# Altium project VESC_MotorController.PrjPcb
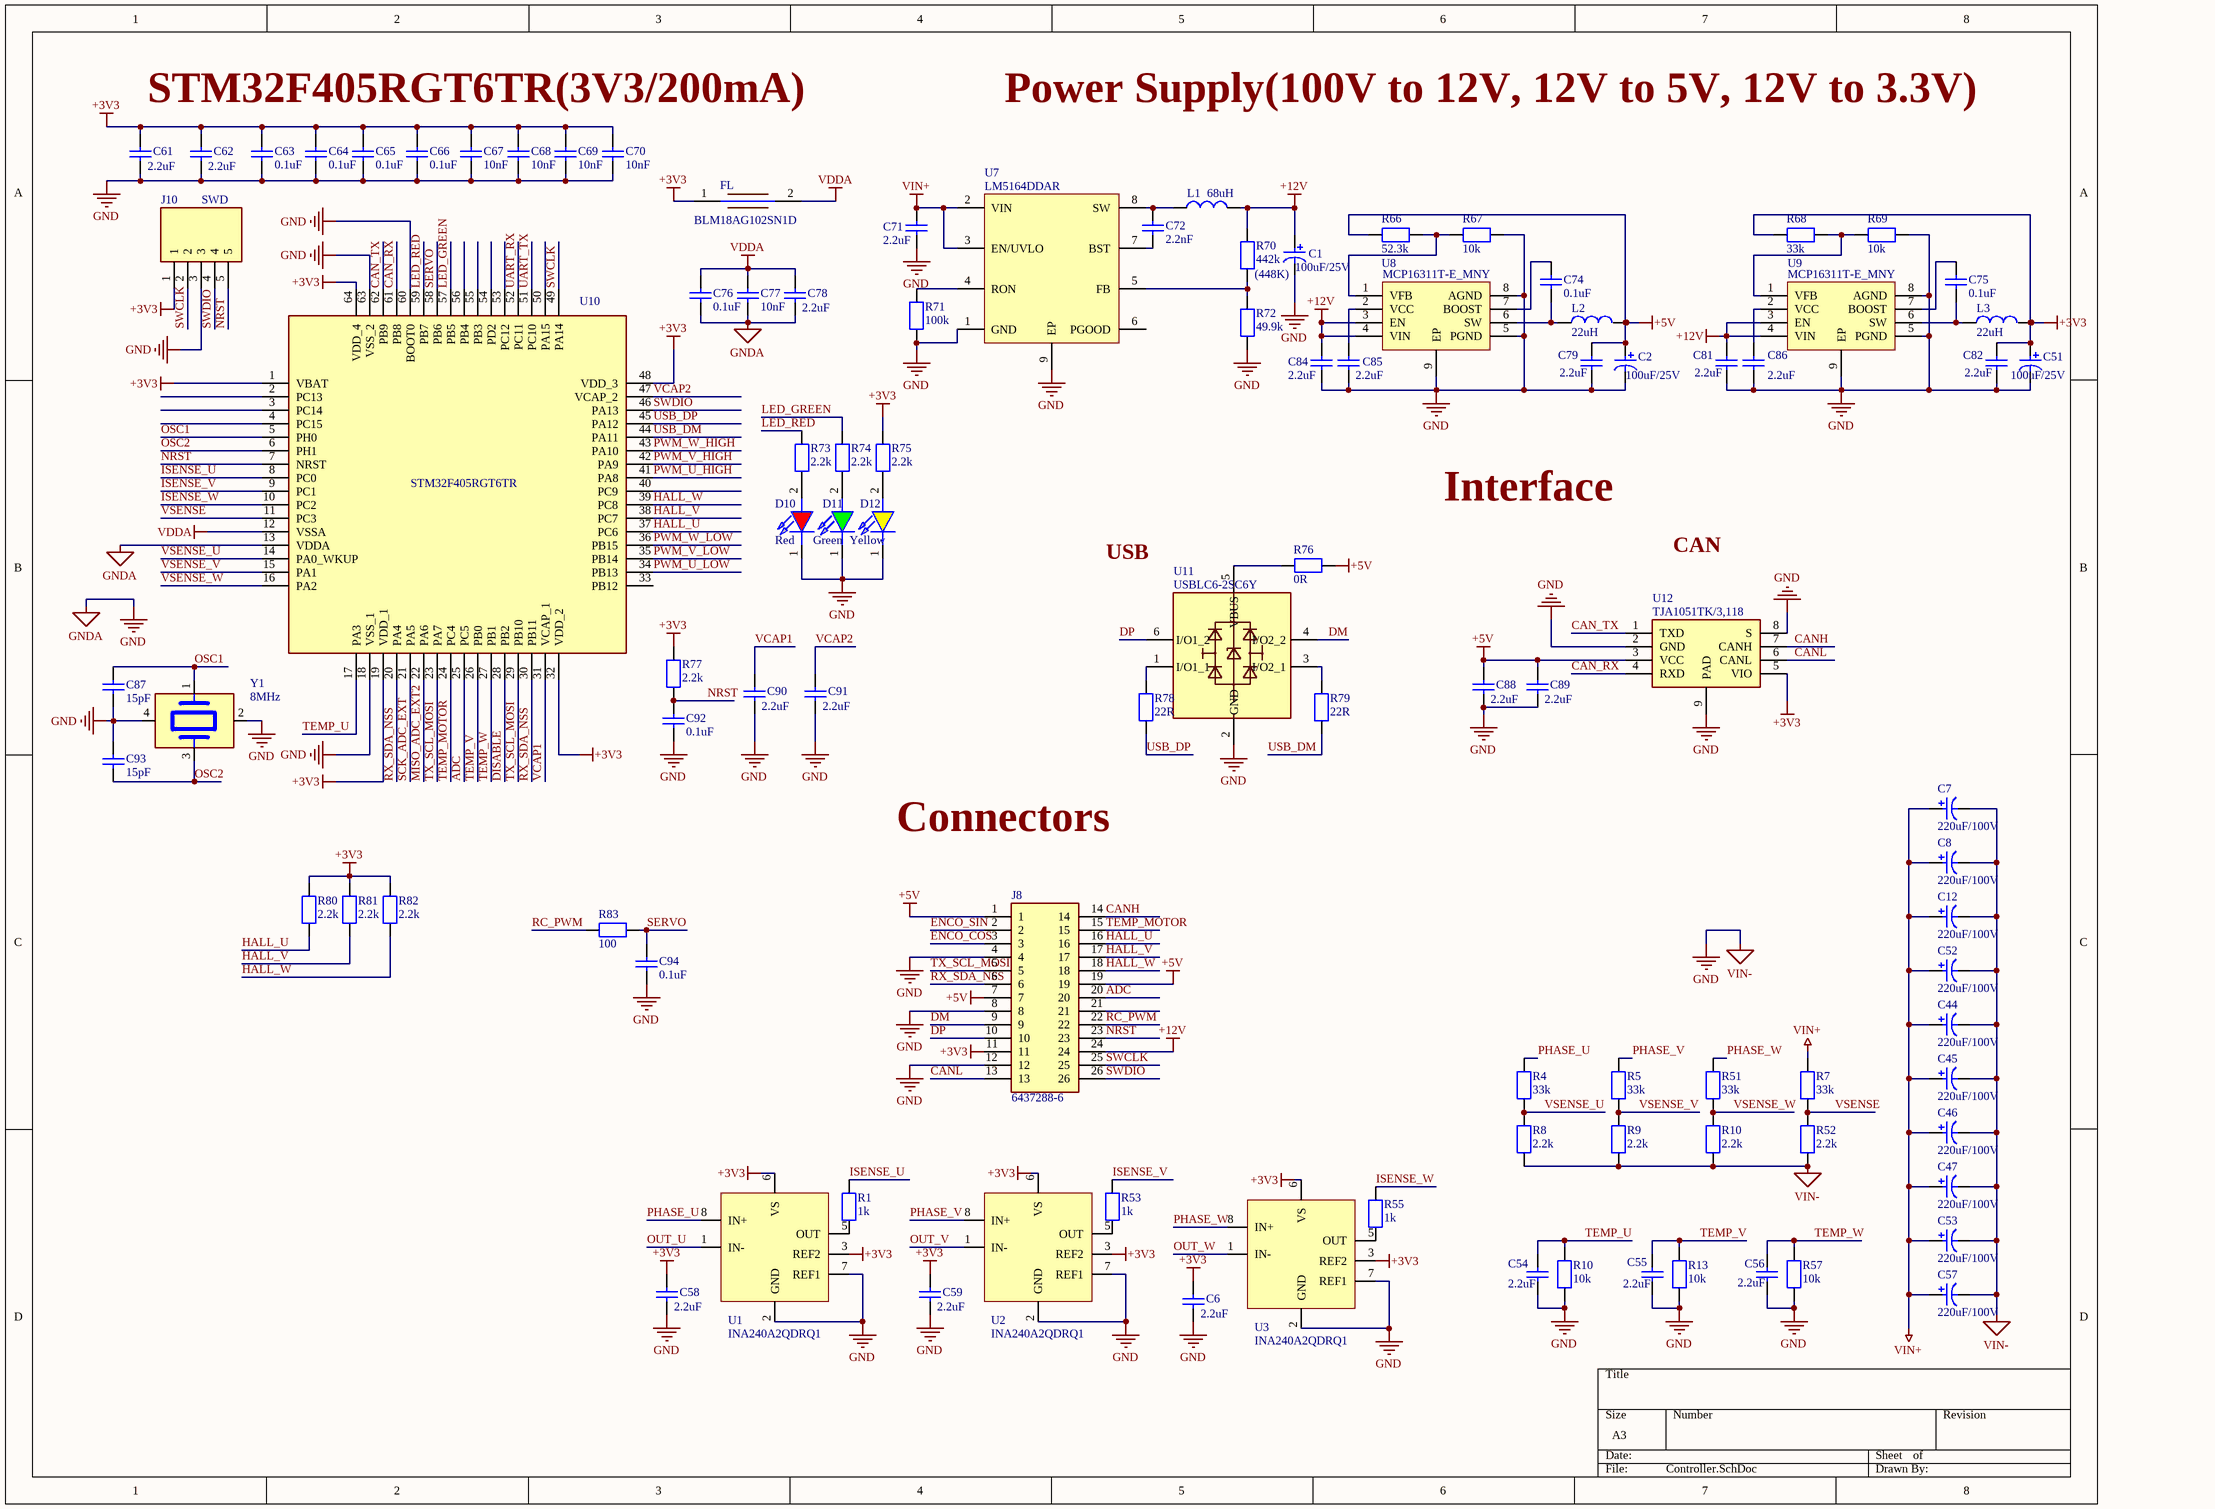
[diagram p0: Controller.SchDoc]
2 sheets, 184 parts. Net scope: global (net labels, ports and power ports of the same name join across sheets).
Board files: PowerBoard.PcbDoc, Controller.PcbDoc
Sheets:
  Controller.SchDoc
  Driver.SchDoc

## Sheet Controller.SchDoc
size A3

### Parts
(Parts that share a designator on the sheet are numbered #1, #2 ... from top to bottom, then left to right.)
C1  100uF/25V  [CAPPRD250W50D630H1250]
C2  100uF/25V  [CAPPRD250W50D630H1250]
C6  2.2uF  [C0805]
C7  220uF/100V  [CAPPRD500W65D1250H2200]
C8  220uF/100V  [CAPPRD500W65D1250H2200]
C12  220uF/100V  [CAPPRD500W65D1250H2200]
C44  220uF/100V  [CAPPRD500W65D1250H2200]
C45  220uF/100V  [CAPPRD500W65D1250H2200]
C46  220uF/100V  [CAPPRD500W65D1250H2200]
C47  220uF/100V  [CAPPRD500W65D1250H2200]
C51  100uF/25V  [CAPPRD250W50D630H1250]
C52  220uF/100V  [CAPPRD500W65D1250H2200]
C53  220uF/100V  [CAPPRD500W65D1250H2200]
C54  2.2uF  [C0805]
C55  2.2uF  [C0805]
C56  2.2uF  [C0805]
C57  220uF/100V  [CAPPRD500W65D1250H2200]
C58  2.2uF  [C0805]
C59  2.2uF  [C0805]
C61  2.2uF  [C0805]
C62  2.2uF  [C0805]
C63  0.1uF  [C0603]
C64  0.1uF  [C0603]
C65  0.1uF  [C0603]
C66  0.1uF  [C0603]
C67  10nF  [C0805]
C68  10nF  [C0805]
C69  10nF  [C0805]
C70  10nF  [C0805]
C71  2.2uF  [C0805]
C72  2.2nF  [C0603]
C74  0.1uF  [C0603]
C75  0.1uF  [C0603]
C76  0.1uF  [C0603]
C77  10nF  [C0805]
C78  2.2uF  [C0805]
C79  2.2uF  [C0805]
C81  2.2uF  [C0805]
C82  2.2uF  [C0805]
C84  2.2uF  [C0805]
C85  2.2uF  [C0805]
C86  2.2uF  [C0805]
C87  15pF  [C0603]
C88  2.2uF  [C0805]
C89  2.2uF  [C0805]
C90  2.2uF  [C0805]
C91  2.2uF  [C0805]
C92  0.1uF  [C0603]
C93  15pF  [C0603]
C94  0.1uF  [C0603]
D10  Red  [LSM0603R]
D11  Green  [LSM0603G]
D12  Yellow  [LSM0603Y]
FL  BLM18AG102SN1D  [BLM18EG121SH1D]
J8  6437288-6  [64372886]
J10  SWD  [61300511021]
L1  68uH  [INDPM7973X540N]
L2  22uH  [INDPM7973X540N]
L3  22uH  [INDPM7973X540N]
R1  1k  [R0603]
R4  33k  [R0603]
R5  33k  [R0603]
R7  33k  [R0603]
R8  2.2k  [R0603]
R9  2.2k  [R0603]
R10#1  2.2k  [R0603]
R10#2  10k  [R0603]
R13  10k  [R0603]
R51  33k  [R0603]
R52  2.2k  [R0603]
R53  1k  [R0603]
R55  1k  [R0603]
R57  10k  [R0603]
R66  52.3k  [R0603]
R67  10k  [R0603]
R68  33k  [R0603]
R69  10k  [R0603]
R70  442k  [R0603]
R71  100k  [R0603]
R72  49.9k  [R0603]
R73  2.2k  [R0603]
R74  2.2k  [R0603]
R75  2.2k  [R0603]
R76  0R  [R1206]
R77  2.2k  [R0603]
R78  22R  [R0603]
R79  22R  [R0603]
R80  2.2k  [R0603]
R81  2.2k  [R0603]
R82  2.2k  [R0603]
R83  100  [R0603]
U1  INA240A2QDRQ1  [SOIC127P600X175-8N]
U2  INA240A2QDRQ1  [SOIC127P600X175-8N]
U3  INA240A2QDRQ1  [SOIC127P600X175-8N]
U7  LM5164DDAR  [SOIC-8(EPAD)]
U8  MCP16311T-E_MNY  [MSOP-8]
U9  MCP16311T-E_MNY  [MSOP-8]
U10  STM32F405RGT6TR  [QFP50P1200X1200X160-64N]
U11  USBLC6-2SC6Y  [SOT95P280X145-6N]
U12  TJA1051TK/3,118  [HVSON-8]
Y1  8MHz  [XTAL_FL0800026Q]

### Nets
+3V3: C6.2 C51.1 C58.2 C59.2 C61.2 C62.2 C63.2 C64.2 C65.2 C66.2 C67.2 C68.2 C69.2 C70.2 C82.2 FL.1 J8.11 J10.1 L3.2 R68.1 R75.2 R77.2 R80.2 R81.2 R82.2 U1.3(REF2) U1.6(VS) U2.3(REF2) U2.6(VS) U3.3(REF2) U3.6(VS) U10.1(VBAT) U10.19(VDD_1) U10.32(VDD_2) U10.48(VDD_3) U10.64(VDD_4) U12.5(VIO)  [project net TEMP_U_VDD]
+5V: C2.1 C79.2 C88.2 C89.2 J8.1 J8.7 J8.19 L2.2 R66.1 R76.2 U12.3(VCC)
+12V: C1.1 C81.2 C84.2 J8.24 L1.2 R70.2 U8.3(EN) U8.4(VIN) U9.3(EN) U9.4(VIN)
GND: C1.2 C2.2 C6.1 C7.2 C8.2 C12.2 C44.2 C45.2 C46.2 C47.2 C51.2 C52.2 C53.2 C54.1 C55.1 C56.1 C57.2 C58.1 C59.1 C61.1 C62.1 C63.1 C64.1 C65.1 C66.1 C67.1 C68.1 C69.1 C70.1 C71.1 C76.1 C77.1 C78.1 C79.1 C81.1 C82.1 C84.1 C85.1 C86.1 C87.1 C88.1 C89.1 C90.1 C91.1 C92.1 C93.2 C94.1 D10.1(K) D11.1(K) D12.1(K) J8.4 J8.8 J8.12 J10.3 R8.1 R9.1 R10#1.1 R10#2.1 R13.1 R52.1 R57.1 R67.2 R69.2 R71.1 R72.1 U1.2(GND) U1.7(REF1) U2.2(GND) U2.7(REF1) U3.2(GND) U3.7(REF1) U7.1(GND) U7.9(EP) U8.5(PGND) U8.8(AGND) U8.9(EP) U9.5(PGND) U9.8(AGND) U9.9(EP) U10.13(VDDA) U10.18(VSS_1) U10.60(BOOT0) U10.63(VSS_2) U11.2(GND) U12.2(GND) U12.8(S) U12.9(PAD) Y1.2(GND) Y1.4(GND)  [also labelled GNDA, VIN-]
VDDA: C76.2 C77.2 C78.2 FL.2 U10.12(VSSA)
VIN+: C7.1 C8.1 C12.1 C44.1 C45.1 C46.1 C47.1 C52.1 C53.1 C57.1 C71.2 R7.2 U7.2(VIN) U7.3(EN/UVLO)
ADC: J8.20 U10.25(PC5)
CAN_RX: U10.61(PB8) U12.4(RXD)
CAN_TX: U10.62(PB9) U12.1(TXD)
CANH: J8.14 U12.7(CANH)
CANL: J8.13 U12.6(CANL)
DISABLE: U10.28(PB2)
DM: J8.9 U11.4(I/O2_2)
DP: J8.10 U11.6(I/O1_2)
ENCO_COS: J8.3
ENCO_SIN: J8.2
HALL_U: J8.16 R80.1 U10.37(PC6)
HALL_V: J8.17 R81.1 U10.38(PC7)
HALL_W: J8.18 R82.1 U10.39(PC8)
ISENSE_U: R1.2 U10.8(PC0)
ISENSE_V: R53.2 U10.9(PC1)
ISENSE_W: R55.2 U10.10(PC2)
LED_GREEN: R74.2 U10.57(PB5)
LED_RED: R73.2 U10.59(PB7)
MISO_ADC_EXT2: U10.22(PA6)
NRST: C92.2 J8.23 J10.5 R77.1 U10.7(NRST)
OSC1: C87.2 U10.5(PH0) Y1.1
OSC2: C93.1 U10.6(PH1) Y1.3
OUT_U: U1.1(IN-)
OUT_V: U2.1(IN-)
OUT_W: U3.1(IN-)
PHASE_U: R4.2 U1.8(IN+)
PHASE_V: R5.2 U2.8(IN+)
PHASE_W: R51.2 U3.8(IN+)
PWM_U_HIGH: U10.41(PA8)
PWM_U_LOW: U10.34(PB13)
PWM_V_HIGH: U10.42(PA9)
PWM_V_LOW: U10.35(PB14)
PWM_W_HIGH: U10.43(PA10)
PWM_W_LOW: U10.36(PB15)
RC_PWM: J8.22 R83.1
RX_SDA_NSS: J8.6 U10.20(PA4) U10.30(PB11)
SCK_ADC_EXT: U10.21(PA5)
SERVO: C94.2 R83.2 U10.58(PB6)
SWCLK: J8.25 J10.2 U10.49(PA14)
SWDIO: J8.26 J10.4 U10.46(PA13)
TEMP_MOTOR: J8.15 U10.24(PC4)
TEMP_U: C54.2 R10#2.2 U10.17(PA3)
TEMP_V: C55.2 R13.2 U10.26(PB0)
TEMP_W: C56.2 R57.2 U10.27(PB1)
TX_SCL_MOSI: J8.5 U10.23(PA7) U10.29(PB10)
UART_RX: U10.52(PC11)
UART_TX: U10.51(PC10)
USB_DM: R79.1 U10.44(PA11)
USB_DP: R78.1 U10.45(PA12)
VCAP1: C90.2 U10.31(VCAP_1)
VCAP2: C91.2 U10.47(VCAP_2)
VSENSE: R7.1 R52.2 U10.11(PC3)
VSENSE_U: R4.1 R8.2 U10.14(PA0_WKUP)
VSENSE_V: R5.1 R9.2 U10.15(PA1)
VSENSE_W: R10#1.2 R51.1 U10.16(PA2)
NetC72_1: C72.1 U7.7(BST)
NetC72_2: C72.2 L1.1 U7.8(SW)
NetC74_1: C74.1 L2.1 U8.6(SW)
NetC74_2: C74.2 U8.7(BOOST)
NetC75_1: C75.1 L3.1 U9.6(SW)
NetC75_2: C75.2 U9.7(BOOST)
NetC85_2: C85.2 U8.2(VCC)
NetC86_2: C86.2 U9.2(VCC)
NetD10_2: D10.2(A) R73.1
NetD11_2: D11.2(A) R74.1
NetD12_2: D12.2(A) R75.1
NetR1_1: R1.1 U1.5(OUT)
NetR53_1: R53.1 U2.5(OUT)
NetR55_1: R55.1 U3.5(OUT)
NetR66_2: R66.2 R67.1 U8.1(VFB)
NetR68_2: R68.2 R69.1 U9.1(VFB)
NetR70_1: R70.1 R72.2 U7.5(FB)
NetR71_2: R71.2 U7.4(RON)
NetR76_1: R76.1 U11.5(VBUS)
NetR78_2: R78.2 U11.1(I/O1_1)
NetR79_2: R79.2 U11.3(I/O2_1)

Not connected (* = marked no-connect by the designer): J8 21; U7 6(PGOOD); U10 2(PC13) 3(PC14) 4(PC15) 33(PB12) 40(PC9) 50(PA15) 53(PC12) 54(PD2) 55(PB3) 56(PB4)

### Notes on the sheet
- STM32F405RGT6TR(3V3/200mA)
- Power Supply(100V to 12V, 12V to 5V, 12V to 3.3V)
- (448K)
- Interface
- (near U11) USB
- CAN
- Connectors

### Library data of the parts
C1 C2 C51 = 100uF ± 10% 25V: Manufacturer: Kemet; Manufacturer Part Number: ESK107M025AE3AA; Value: 100uF/25V; Supplier: mouser; Supplier Part Number: 80-ESK107M025AE3AA; Price: 0.25
C6 C54-C56 C58 C59 C61 C62 C71 C78 C79 C81 C82 C84-C86 C88-C91 = Cap 2.2uF ± 10% 50V: Multilayer Ceramic Capacitors MLCC - SMD/SMT 50 V 2.2uF X7R 0805 10%; Manufacturer: Yageo; Manufacturer Part Number: CC0805KKX7R9BB225; Value: 2.2uF/50V; Supplier: mouser; Supplier Part Number: 603-CC805KKX7R9BB225; Price: 0.36
C7 C8 C12 C44-C47 C52 C53 C57 = ECap 220uF ± 20% 100V: Aluminium Electrolytic Capacitors - Radial Leaded 220uF 100V; Manufacturer: Panasonic; Manufacturer Part Number: ECA-2AM221; Supplier Part Number: 667-ECA-2AM221; Supplier: Mouser; Price: 0.95; Value: 220uF/100V
C63-C66 C74-C76 C92 C94 = Cap 100nF ± 10% 50V: Multilayer Ceramic Capacitors MLCC - SMD/SMT 50 V 0.1uF X7R 0603 10%; Manufacturer: Yageo; Manufacturer Part Number: CC0603KRX7R9BB104; Value: 0.1uF; Supplier: mouser; Supplier Part Number: 603-CC603KRX7R9BB104; Price: 0.1
C67-C70 C77 = Cap 10nF ± 10% 100V: Multilayer Ceramic Capacitors MLCC - SMD/SMT 100V 0.01uF X7R 10% 0805; Manufacturer: Yageo; Manufacturer Part Number: CC0805KRX7R0BB103; Value: 10nF; Supplier: mouser; Supplier Part Number: 603-CC0805KRX7R0BB103; Price: 0.1
C72 = Cap 2.2nF ± 10% 50V: Multilayer Ceramic Capacitors MLCC - SMD/SMT 50V 2200pF X7R 0603 10%; Manufacturer: Yageo; Manufacturer Part Number: CC0603KRX7R9BB222; Value: 2.2nF; Supplier: mouser; Supplier Part Number: 603-CC0603KRX7R9BB222; Price: 0.1
C87 C93 = Cap 15pF ± 10% 50V: Multilayer Ceramic Capacitors MLCC - SMD/SMT 50 V 15 pF C0G 0603 10%; Manufacturer: Yageo; Manufacturer Part Number: CC0603KRNPO9BN150; Value: 15pF; Supplier: mouser; Supplier Part Number: 603-CC0603KRNPO9BN150; Price: 0.1
D10 = Led 0603 Red: Standard LEDs - SMD SMD 0603 2V 100mcd RED; Manufacturer: VCC; Manufacturer Part Number: LSM0603412V; Supplier Part Number: 593-LSM0603412V; Supplier: Mouser; Value: Red; Price: 0.39
D11 = Led 0603 Green: Standard LEDs - SMD SMD 0603 3V 1000mcd GREEN; Manufacturer: VCC; Manufacturer Part Number: LSM0603453V; Supplier Part Number: 593-LSM0603453V; Supplier: Mouser; Value: Green; Price: 0.44
D12 = Led 0603 Yellow: Standard LEDs - SMD SMD 0603 2V 150mcd YELLOW; Manufacturer: VCC; Manufacturer Part Number: LSM0603472V; Supplier Part Number: 593-LSM0603472V; Supplier: Mouser; Value: Yellow; Price: 0.29
FL = BLM18AG102SN1D: Ferrite Beads 1000 OHM 25% Alternate Sizing Guide Below; Manufacturer: Murata; Manufacturer Part Number: BLM18AG102SN1D; Price: 0.15; Supplier Part Number: 81-BLM11A102S; Value: BLM18AG102SN1D; Supplier: Mouser
J8 = Header Vert 26 pin: Header vert 26 way 4 row Tab Superseal; Manufacturer: TE Connectivity; Supplier Part Number: 571-6437288-6; Supplier: Mouser; Manufacturer Part Number: 6437288-6; Value: 6437288-6; Price: 2
J10 = Header 5 Pin_1: Headers & Wire Housings WR-PHD 2.54mm Hdr 5P Single RA Gold; Manufacturer: Wurth Electronic; Value: 61300511021; Supplier Part Number: 710-61300511021; Supplier: Mouser; Manufacturer Part Number: 61300511021; Price: 0.44
L1 = Inductor 68uH ±20% 2.7A: Power Inductors - SMD Ind,7.9x7.3x5.2mm,68uH+/-20%,2.7A,shd; Manufacturer: Bourns; Manufacturer Part Number: SRP7050WA-680M; Supplier Part Number: 652-SRP7050WA-680M; Supplier: Mouser; Price: 1; Value: 68uH
L2 L3 = Inductor 22uH ±20% 5A: Power Inductors - SMD Ind,7.9x7.3x5.2mm,22uH+/-20%,5A,shd; Manufacturer: Bourns; Manufacturer Part Number: SRP7050WA-220M; Supplier Part Number: 652-SRP7050WA-220M; Supplier: Mouser; Price: 1; Value: 22uH
R1 R53 R55 = Res 1kOhms ±1% 0.1W: Thick Film Resistors - SMD 1 kOhms 100mW 0603 1%; Manufacturer: Yageo; Manufacturer Part Number: RC0603FR-071KL; Value: 1k; Supplier: Mouser; Supplier Part Number: 603-RC0603FR-071KL; Price: 0.1
R4 R5 R7 R51 R68 = Res 33kOhms ±1% 0.1W: Thick Film Resistors - SMD 33 kOhms 100mW 0603 1%; Manufacturer: Yageo; Manufacturer Part Number: RC0603FR-0733KL; Value: 33k; Supplier: mouser; Supplier Part Number: 603-RC0603FR-0733KL; Price: 0.1
R8 R9 R10#1 R52 R73-R75 R77 R80-R82 = Res 2.2kOhms ±1% 0.1W: Thick Film Resistors - SMD 2.2 kOhms 100mW 0603 1%; Manufacturer: Yageo; Manufacturer Part Number: RC0603FR-072K2L; Value: 2.2k; Supplier: Mouser; Supplier Part Number: 603-RC0603FR-072K2L; Price: 0.1
R10#2 R13 R57 R67 R69 = Res 10kOhms ±1% 0.1W: Thick Film Resistors - SMD 10 kOhms 100mW 0603 1%; Manufacturer: Yageo; Manufacturer Part Number: RC0603FR-0710KL; Value: 10k; Supplier: mouser; Supplier Part Number: 603-RC0603FR-0710KL; Price: 0.1
R66 = Res 52.3kOhms ±1% 0.1W: hick Film Resistors - SMD 52.3 kOhms 100mW 0603 1%; Manufacturer: Yageo; Manufacturer Part Number: RC0603FR-0752K3L; Value: 52.3k; Supplier: mouser; Supplier Part Number: 603-RC0603FR-0752K3L; Price: 0.1
R70 = Res 442kOhms ±1% 0.1W: Thick Film Resistors - SMD 442 kOhms 100 mW 0603 1%; Manufacturer: Yageo; Manufacturer Part Number: RC0603FR-07442KL; Value: 442k; Supplier: Mouser; Supplier Part Number: 603-RC0603FR-07442KL; Price: 0.1
R71 = Res 100kOhms ±1% 0.1W: Thick Film Resistors - SMD 100 kOhms 100mW 0603 1%; Manufacturer: Yageo; Manufacturer Part Number: RC0603FR-07100KL; Value: 100k; Supplier: mouser; Supplier Part Number: 603-RC0603FR-07100KL; Price: 0.1
R72 = Res 49.9kOhms ±1% 0.1W: Thick Film Resistors - SMD 49.9K Ohms 100mW 1% 0603; Manufacturer: Yageo; Manufacturer Part Number: RC0603FR-0749K9L; Value: 49.9k; Supplier: mouser; Supplier Part Number: 603-RC0603FR-0749K9L; Price: 0.1
R76 = Res 0ohm ±1% 0.25W: Thick Film Resistors - SMD 0 Ohms 250 mW 1206 1%; Manufacturer Part Number: RC1206FR-070RL; Manufacturer: Yageo; Value: 0R; Supplier: Mouser; Supplier Part Number: 603-RC1206FR-070RL; Price: 0.1
R78 R79 = Res 22ohm ±1% 0.1W: Thick Film Resistors - SMD 22 Ohms 100mW 0603 1%; Manufacturer Part Number: RC0603FR-0722RL; Manufacturer: Yageo; Value: 22R; Supplier: Mouser; Supplier Part Number: 603-RC0603FR-0722RL; Price: 0.1
R83 = Res 100Ohms ±1% 0.1W: Thick Film Resistors - SMD 100 Ohms 100mW 0603 1%; Manufacturer: Yageo; Manufacturer Part Number: RC0603FR-07100RL; Value: 100; Supplier: Mouser; Supplier Part Number: 603-RC0603FR-07100RL; Price: 0.1
U1-U3 = INA240A2QDRQ1: Automotive, High/Low Side, Bi-Directional Zer-Drift Current Sense Amp w/ Enhanced PWM Rejection; Manufacturer: Texas Instruments; Supplier Part Number: 595-INA240A2QDRQ1; Supplier: Mouser; Manufacturer Part Number: INA240A2QDRQ1; Price: 3.8; Value: INA240A2QDRQ1
U7 = LM5164DDAR: Texas Instruments 6-V to 100-V Input, 1-A Synchronous Buck DC-DC Converter With Ultra-Low IQ 8-SO PowerPAD -40 to 150; Value: 1.7mm; Supplier Part Number: 595-LM5164DDAR; Price: 3.5; Manufacturer: Texas Instruments; Manufacturer Part Number: LM5164DDAR; Supplier: Mouser
U8 U9 = MCP16311T-E_MNY: Microchip, MCP16311T-E/MNY Step Down DC-DC Converter 1A Adjustable, 2  24 V 8-Pin, TDFN; Supplier Part Number: 579-MCP16311T-E/MNY; Price: 1.8; Manufacturer: Microchip; Manufacturer Part Number: MCP16311T-E/MNY; Value: MCP16311T-E/MNY; Supplier: Mouser
U10 = STM32F405RGT6TR: STM32F405RGT6TR, 32 bit ARM Cortex M4 MCU 168MHz 1024 kB Flash, 192 kB RAM, 2xUSB CAN I2C 64-Pin LQFP; Manufacturer: STMicroelectronics; Supplier Part Number: 511-STM32F405RGT6TR; Supplier: Mouser; Manufacturer Part Number: STM32F405RGT6TR; Value: STM32F405RGT6TR; Price: 11.6
U11 = USBLC6-2SC6Y: Low Cap. ESD Protection Auto SOT-23-6 STMicroelectronics USBLC6-2SC6Y, Dual Uni-Directional TVS Diode Array, 6-Pin SOT-23; Supplier Part Number: 511-USBLC6-2SC6Y; Supplier: Mouser; Manufacturer Part Number: USBLC6-2SC6Y; Price: 1.45; Manufacturer: STMicroelectronics; Value: USBLC6-2SC6Y
U12 = TJA1051TK/3,118: CAN Interface IC BL Advanced Automotive Analog; Manufacturer: NXP Semiconductors; Supplier Part Number: 771-TJA1051TK/3,118; Supplier: Mouser; Manufacturer Part Number: TJA1051TK/3,118; Price: 1.6; Value: TJA1051TK/3,118
Y1 = CrystalOscilator 8MHz: 8 MHz A±30ppm Crystals Crystal Ceramic SEAM3225 T&R 3K; Manufacturer: Diodes Incorporated; Manufacturer Part Number: FL0800026Q; Price: 0.38; Value: 8MHz; Supplier: Mouser; Supplier Part Number: 621-FL0800026Q

## Sheet Driver.SchDoc
size A3
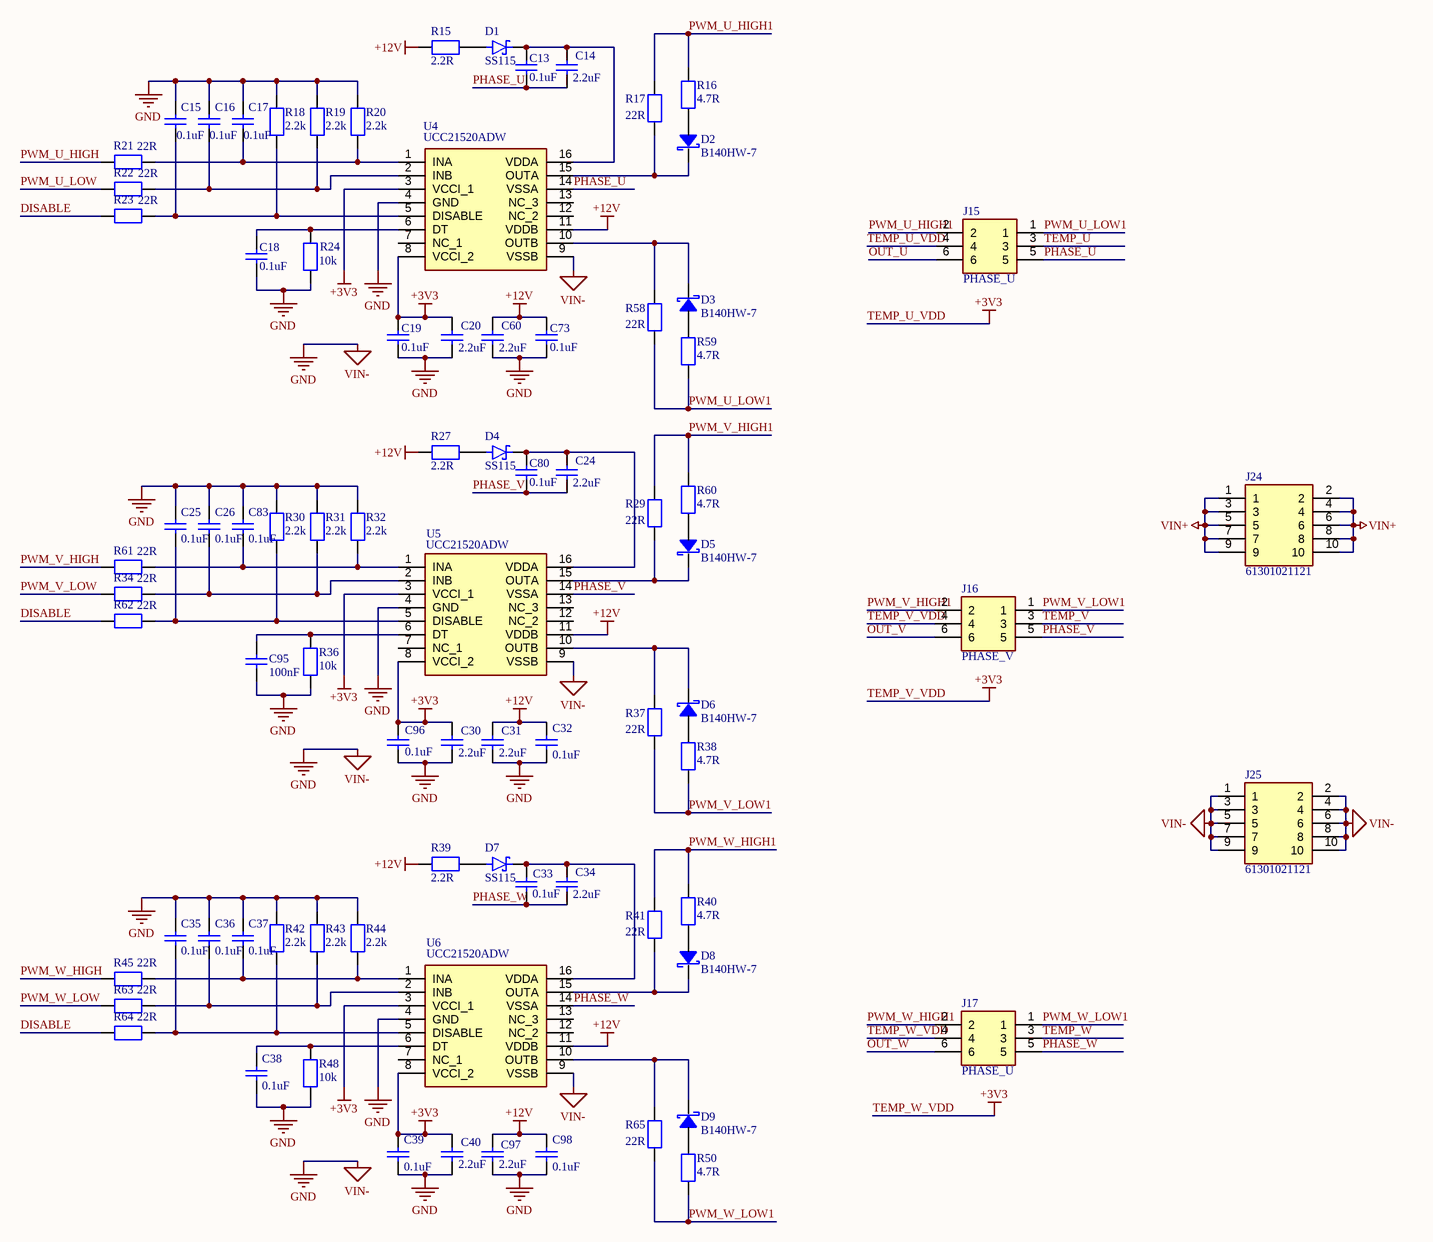
[diagram p1: Driver.SchDoc]

### Parts
C13  0.1uF  [C0603]
C14  2.2uF  [C0805]
C15  0.1uF  [C0603]
C16  0.1uF  [C0603]
C17  0.1uF  [C0603]
C18  0.1uF  [C0603]
C19  0.1uF  [C0603]
C20  2.2uF  [C0805]
C24  2.2uF  [C0805]
C25  0.1uF  [C0603]
C26  0.1uF  [C0603]
C30  2.2uF  [C0805]
C31  2.2uF  [C0805]
C32  0.1uF  [C0603]
C33  0.1uF  [C0603]
C34  2.2uF  [C0805]
C35  0.1uF  [C0603]
C36  0.1uF  [C0603]
C37  0.1uF  [C0603]
C38  0.1uF  [C0603]
C39  0.1uF  [C0603]
C40  2.2uF  [C0805]
C60  2.2uF  [C0805]
C73  0.1uF  [C0603]
C80  0.1uF  [C0603]
C83  0.1uF  [C0603]
C95  100nF  [C0603]
C96  0.1uF  [C0603]
C97  2.2uF  [C0805]
C98  0.1uF  [C0603]
D1  SS115  [DIOM4325X250N]
D2  B140HW-7  [SOD123]
D3  B140HW-7  [SOD123]
D4  SS115  [DIOM4325X250N]
D5  B140HW-7  [SOD123]
D6  B140HW-7  [SOD123]
D7  SS115  [DIOM4325X250N]
D8  B140HW-7  [SOD123]
D9  B140HW-7  [SOD123]
J15  PHASE_U  [61300621121]
J16  PHASE_V  [61300621121]
J17  PHASE_U  [61300621121]
J24  61301021121  [HDRV10W64P254X254_2X5_1270X508X869P]
J25  61301021121  [HDRV10W64P254X254_2X5_1270X508X869P]
R15  2.2R  [R0603]
R16  4.7R  [R0603]
R17  22R  [R0603]
R18  2.2k  [R0603]
R19  2.2k  [R0603]
R20  2.2k  [R0603]
R21  22R  [R0603]
R22  22R  [R0603]
R23  22R  [R0603]
R24  10k  [R0603]
R27  2.2R  [R0603]
R29  22R  [R0603]
R30  2.2k  [R0603]
R31  2.2k  [R0603]
R32  2.2k  [R0603]
R34  22R  [R0603]
R36  10k  [R0603]
R37  22R  [R0603]
R38  4.7R  [R0603]
R39  2.2R  [R0603]
R40  4.7R  [R0603]
R41  22R  [R0603]
R42  2.2k  [R0603]
R43  2.2k  [R0603]
R44  2.2k  [R0603]
R45  22R  [R0603]
R48  10k  [R0603]
R50  4.7R  [R0603]
R58  22R  [R0603]
R59  4.7R  [R0603]
R60  4.7R  [R0603]
R61  22R  [R0603]
R62  22R  [R0603]
R63  22R  [R0603]
R64  22R  [R0603]
R65  22R  [R0603]
U4  UCC21520ADW  [SOIC127P1030X265-16N]
U5  UCC21520ADW  [SOIC127P1030X265-16N]
U6  UCC21520ADW  [SOIC127P1030X265-16N]

### Nets
+12V: C31.2 C32.2 C60.2 C73.2 C97.2 C98.2 R15.1 R27.1 R39.1 U4.11(VDDB) U5.11(VDDB) U6.11(VDDB)
GND: C15.2 C16.2 C17.2 C18.1 C19.1 C20.1 C25.2 C26.2 C30.1 C31.1 C32.1 C35.2 C36.2 C37.2 C38.1 C39.1 C40.1 C60.1 C73.1 C83.2 C95.1 C96.1 C97.1 C98.1 J25.1 J25.2 J25.3 J25.4 J25.5 J25.6 J25.7 J25.8 J25.9 J25.10 R18.2 R19.2 R20.2 R24.1 R30.2 R31.2 R32.2 R36.1 R42.2 R43.2 R44.2 R48.1 U4.4(GND) U4.9(VSSB) U5.4(GND) U5.9(VSSB) U6.4(GND) U6.9(VSSB)  [also labelled VIN-]
TEMP_U_VDD: C19.2 C20.2 C30.2 C39.2 C40.2 C96.2 J15.4 J16.4 J17.4 U4.3(VCCI_1) U4.8(VCCI_2) U5.3(VCCI_1) U5.8(VCCI_2) U6.3(VCCI_1) U6.8(VCCI_2)  [also labelled +3V3, TEMP_V_VDD, TEMP_W_VDD]
VIN+: J24.1 J24.2 J24.3 J24.4 J24.5 J24.6 J24.7 J24.8 J24.9 J24.10
DISABLE: R23.1 R62.1 R64.1
OUT_U: J15.6
OUT_V: J16.6
OUT_W: J17.6
PHASE_U: C13.1 C14.1 J15.5 U4.14(VSSA)
PHASE_V: C24.1 C80.1 J16.5 U5.14(VSSA)
PHASE_W: C33.1 C34.1 J17.5 U6.14(VSSA)
PWM_U_HIGH: R21.1
PWM_U_HIGH1: J15.2 R16.2 R17.2
PWM_U_LOW: R22.1
PWM_U_LOW1: J15.1 R58.1 R59.1
PWM_V_HIGH: R61.1
PWM_V_HIGH1: J16.2 R29.2 R60.2
PWM_V_LOW: R34.1
PWM_V_LOW1: J16.1 R37.1 R38.1
PWM_W_HIGH: R45.1
PWM_W_HIGH1: J17.2 R40.2 R41.2
PWM_W_LOW: R63.1
PWM_W_LOW1: J17.1 R50.1 R65.1
TEMP_U: J15.3
TEMP_V: J16.3
TEMP_W: J17.3
NetC13_2: C13.2 C14.2 D1.C(K) U4.16(VDDA)
NetC15_1: C15.1 R18.1 R23.2 U4.5(DISABLE)
NetC16_1: C16.1 R19.1 R22.2 U4.2(INB)
NetC17_1: C17.1 R20.1 R21.2 U4.1(INA)
NetC18_2: C18.2 R24.2 U4.6(DT)
NetC24_2: C24.2 C80.2 D4.C(K) U5.16(VDDA)
NetC25_1: C25.1 R30.1 R62.2 U5.5(DISABLE)
NetC26_1: C26.1 R31.1 R34.2 U5.2(INB)
NetC33_2: C33.2 C34.2 D7.C(K) U6.16(VDDA)
NetC35_1: C35.1 R42.1 R64.2 U6.5(DISABLE)
NetC36_1: C36.1 R43.1 R63.2 U6.2(INB)
NetC37_1: C37.1 R44.1 R45.2 U6.1(INA)
NetC38_2: C38.2 R48.2 U6.6(DT)
NetC83_1: C83.1 R32.1 R61.2 U5.1(INA)
NetC95_2: C95.2 R36.2 U5.6(DT)
NetD1_A: D1.A R15.2
NetD2_A: D2.A R16.1
NetD2_C: D2.C R17.1 U4.15(OUTA)
NetD3_A: D3.A R59.2
NetD3_C: D3.C R58.2 U4.10(OUTB)
NetD4_A: D4.A R27.2
NetD5_A: D5.A R60.1
NetD5_C: D5.C R29.1 U5.15(OUTA)
NetD6_A: D6.A R38.2
NetD6_C: D6.C R37.2 U5.10(OUTB)
NetD7_A: D7.A R39.2
NetD8_A: D8.A R40.1
NetD8_C: D8.C R41.1 U6.15(OUTA)
NetD9_A: D9.A R50.2
NetD9_C: D9.C R65.2 U6.10(OUTB)

Not connected (* = marked no-connect by the designer): U4 7(NC_1) 12(NC_2) 13(NC_3); U5 7(NC_1) 12(NC_2) 13(NC_3); U6 7(NC_1) 12(NC_2) 13(NC_3)

### Notes on the sheet
- THIS DOCUMENT AND THE DATA DISCLOSED HEREIN OR
- HEREWITH IS THE PROPERTY OF ALTIUM LIMITED AND MAY
- DWG NO:
- REVISION
- REV:
- DESCRIPTION
- DATE
- APPROVED
- BE FREELY DISTRIBUTED IN WHOLE. NO RIGHTS ARE
- RESERVED OR EXPRESS OR IMPLIED WARANTEE GIVEN.
- ENG:
- APPROVALS
- PROJECT
- DSN:
- CHK:
- REFERENCE DOCUMENTS
- PROJECT REVISION:
- TITLE
- DOCUMENT REVISION:
- DESIGN ITEM:
- BOM:
- FAB DWG:
- PCB DWG:
- ASSY DWG:
- SCALE:
- A3
- SIZE
- CAGE CODE
- FILE NAME
- DWG NO.
- SHEET
- OF
- REV

### Library data of the parts
C13 C15-C19 C25 C26 C32 C33 C35-C39 C73 C80 C83 C96 C98 = Cap 100nF ± 10% 50V: as C63 on sheet Controller; Value: 0.1uF; Supplier: mouser; Supplier Part Number: 603-CC603KRX7R9BB104; Price: 0.1
C14 C20 C24 C30 C31 C34 C40 C60 C97 = Cap 2.2uF ± 10% 50V: as C6 on sheet Controller; Supplier: mouser; Supplier Part Number: 603-CC805KKX7R9BB225; Price: 0.36
C95 = 100nF ± 10% 50V: Manufacturer: Yageo; Manufacturer Part Number: CS0603KRX7R9BB104; Value: 100nF; Supplier: mouser; Supplier Part Number: 603-CS0603KRX79BB104; Price: 0.1
D1 D4 D7 = S Diodes & Rectifiers 1A 150V: Schottky Diodes & Rectifiers 1A, 150V, Schottky Rectifier; Manufacturer: Taiwan Semiconductor; Value: SS115; Price: 0.34; Supplier: Mouser; Manufacturer Part Number: SS115; Supplier Part Number: 821-SS115
D2 D3 D5 D6 D8 D9 = S Diodes & Rectifiers 1A 40V: Schottky Diodes & Rectifiers SCHOTTKY RECTIFIER SOD-123 1.0A 40V; Value: B140HW-7; Manufacturer Part Number: B140HW-7; Manufacturer: Diodes; Supplier: Mouser; Supplier Part Number: 621-B140HW-7; Price: 0.44
J15-J17 = Header 6 Pin_2: WR-PHD 2.54mm  Dual Pin Header THT 06p Wurth Elektronik WR-PHD Series, Series Number 6130, 2.54mm Pitch 6 Way 2 Row Straight PCB Header, Solder Termination; Value: 61300621121; Supplier Part Number: 710-61300621121; Supplier: Mouser; Manufacturer: Wurth Elektronik; Manufacturer Part Number: 61300621121; Price: 0.57
J24 J25 = 61301021121: Wurth Elektronik WR-PHD, 10 Way, 2 Row, Straight Pin Header; Priice: 1; Supplier Part Number: 710-61301021121; Manufacturer: Wurth Elektronik; Manufacturer Part Number: 61301021121; Value: 61301021121; Supplier: Mouser
R15 R27 R39 = Res 2.2ohm ±1% 0.1W: Thick Film Resistors - SMD 2.2 Ohms 100mW 0603 1%; Manufacturer Part Number: RC0603FR-072R2L; Manufacturer: Yageo; Value: 2.2R; Supplier: Mouser; Supplier Part Number: 603-RC0603FR-072R2L; Price: 0.1
R16 R38 R40 R50 R59 R60 = Res 4.7ohm ±1% 0.1W: Thick Film Resistors - SMD 4.7 Ohms 100mW 0603 1%; Manufacturer Part Number: RC0603FR-074R7L; Manufacturer: Yageo; Value: 4.7R; Supplier: Mouser; Supplier Part Number: 603-RC0603FR-074R7L; Price: 0.12
R17 R21-R23 R29 R34 R37 R41 R45 R58 R61-R65 = Res 22ohm ±1% 0.1W: as R78 on sheet Controller; Value: 22R; Supplier: Mouser; Supplier Part Number: 603-RC0603FR-0722RL; Price: 0.1
R18-R20 R30-R32 R42-R44 = 2.2 kOhms ±1% 0.1W: Manufacturer: Yageo; Manufacturer Part Number: RC0603FR-072K2L; Value: 2.2k; Supplier: Mouser; Supplier Part Number: 603-RC0603FR-072K2L; Price: 0.1
R24 R36 R48 = 10 kOhms ±1% 0.1W: Manufacturer: Yageo; Manufacturer Part Number: RC0603FR-0710KL; Value: 10k; Supplier: mouser; Supplier Part Number: 603-RC0603FR-0710KL; Price: 0.1
U4-U6 = UCC21520ADW: 4A/6A, 5.7 kVrms Isolated Dual Channel Gate Driver; Manufacturer: Texas Instruments; Supplier Part Number: 595-UCC21520ADW; Value: UCC21520ADW; Manufacturer Part Number: UCC21520ADW; Price: 7.6; Supplier: Mouser

## Nets that join several sheets
+12V: Controller (10 pins), Driver (12 pins)
GND: Controller (89 pins), Driver (52 pins)
TEMP_U_VDD: Controller (37 pins), Driver (15 pins)
VIN+: Controller (14 pins), Driver (10 pins)
DISABLE: Controller (U10.28), Driver (R23.1 R62.1 R64.1)
OUT_U: Controller (U1.1), Driver (J15.6)
OUT_V: Controller (U2.1), Driver (J16.6)
OUT_W: Controller (U3.1), Driver (J17.6)
PHASE_U: Controller (R4.2 U1.8), Driver (C13.1 C14.1 J15.5 U4.14)
PHASE_V: Controller (R5.2 U2.8), Driver (C24.1 C80.1 J16.5 U5.14)
PHASE_W: Controller (R51.2 U3.8), Driver (C33.1 C34.1 J17.5 U6.14)
PWM_U_HIGH: Controller (U10.41), Driver (R21.1)
PWM_U_LOW: Controller (U10.34), Driver (R22.1)
PWM_V_HIGH: Controller (U10.42), Driver (R61.1)
PWM_V_LOW: Controller (U10.35), Driver (R34.1)
PWM_W_HIGH: Controller (U10.43), Driver (R45.1)
PWM_W_LOW: Controller (U10.36), Driver (R63.1)
TEMP_U: Controller (C54.2 R10#2.2 U10.17), Driver (J15.3)
TEMP_V: Controller (C55.2 R13.2 U10.26), Driver (J16.3)
TEMP_W: Controller (C56.2 R57.2 U10.27), Driver (J17.3)

## Assembly variants
External Regulator Board: not fitted C28 C29 C30 C31 C32 C33 C34 C35 C36 C37 C38 C39 C40 C41 C42 C43 C44 C45 C46 C47 C48 C49 D2 D3 D4 D5 L1 L2 Q1 Q2 Q3 Q6 Q7 Q9 R40 R43 R44 R45 R46 R51 R52 R53 R54 R55 R56 R57 R59 R60 R63 R64 R65 R66 R67 R68 R69 R70 U7 U9
Onboard Regulators: all parts fitted
Variant of VESC_MotorController: all parts fitted
Variant of VESC_MotorController_1: all parts fitted